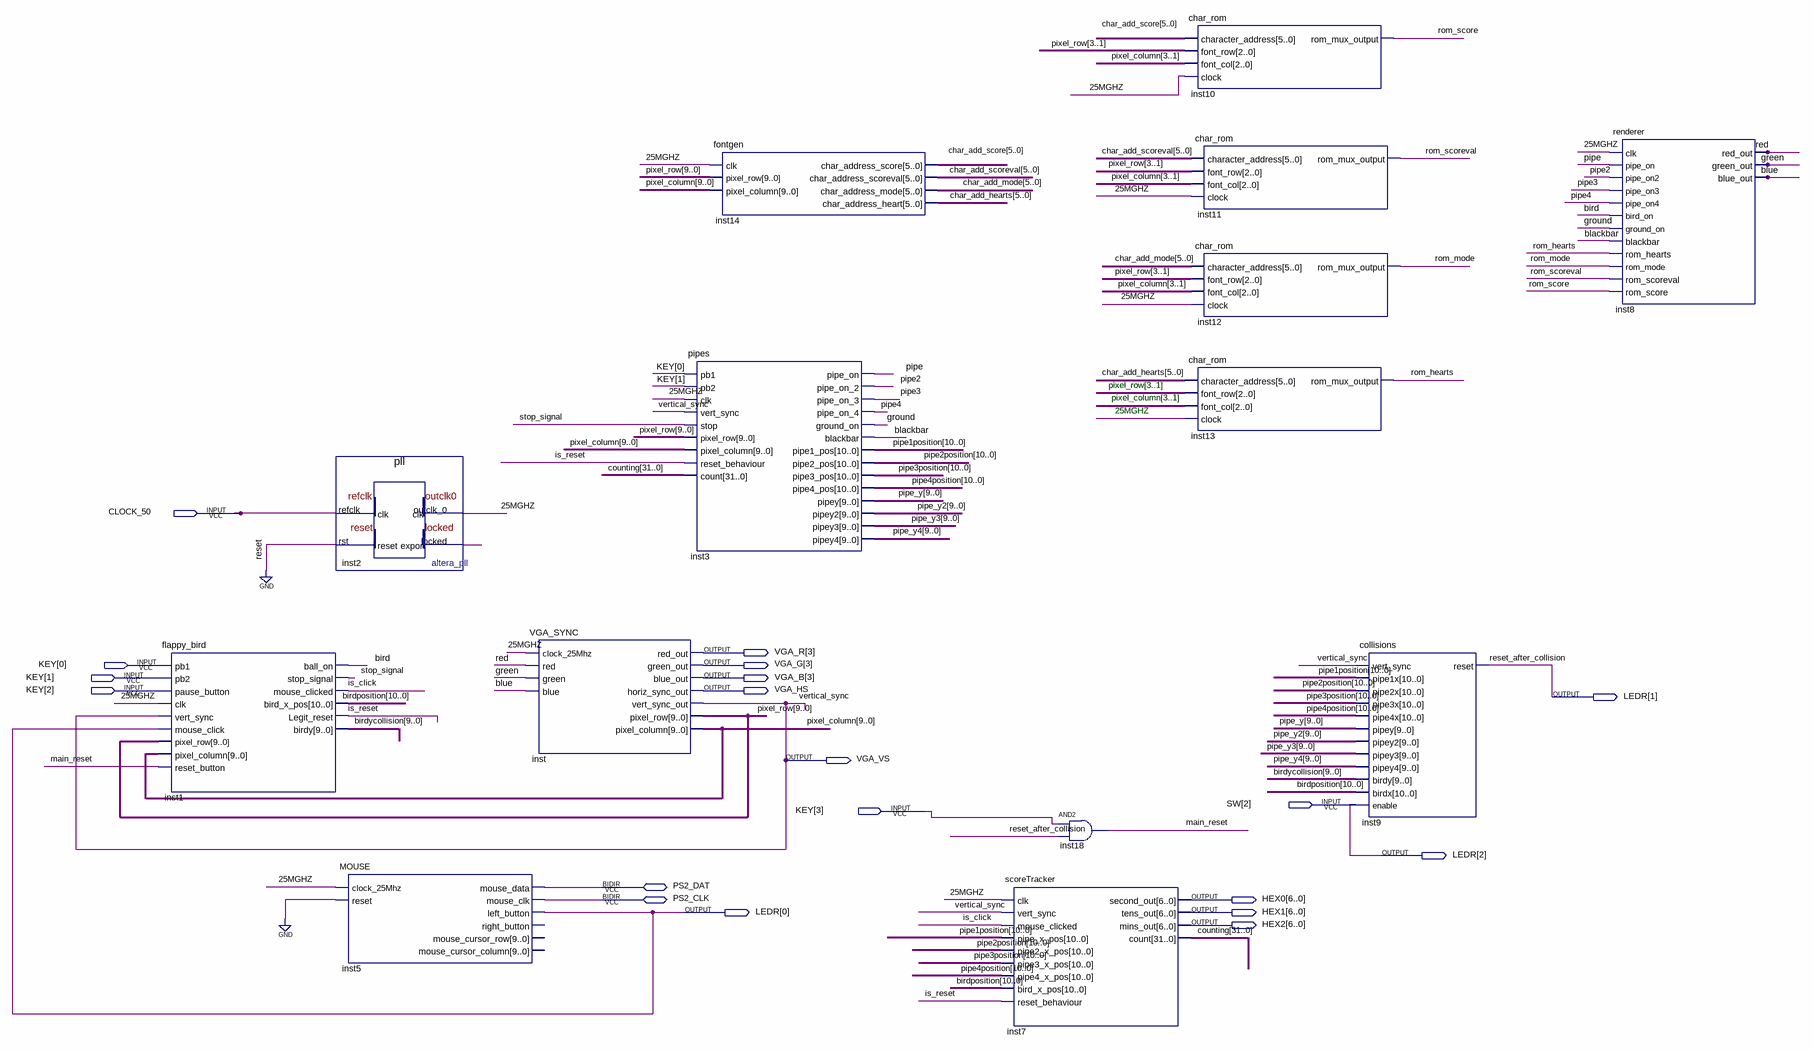
[diagram p0: schematic sheet]
// Quartus schematic FlappyBird.bdf as structural Verilog: 14 symbols, 19 pins
module FlappyBird (
  input  CLOCK_50,
  input  [3:0] KEY,
  input  [2:2] SW,
  inout  PS2_DAT,
  inout  PS2_CLK,
  output [3:3] VGA_R,
  output [3:3] VGA_G,
  output [3:3] VGA_B,
  output VGA_HS,
  output [2:0] LEDR,
  output VGA_VS,
  output [6:0] HEX0,
  output [6:0] HEX1,
  output [6:0] HEX2
);

  wire \25MGHZ , bird, blackbar, blue, green, ground, inst2_locked, is_click, is_reset, main_reset, pipe,
       pipe2, pipe3, pipe4, red, rom_hearts, rom_mode, rom_score, rom_scoreval, stop_signal;
  wire [5:0] char_add_hearts, char_add_mode, char_add_score, char_add_scoreval;
  wire [9:0] birdycollision, pipe_y, pipe_y2, pipe_y3, pipe_y4, pixel_column, pixel_row;
  wire [10:0] birdposition, pipe1position, pipe2position, pipe3position, pipe4position;
  wire [31:0] counting;

  flappy_bird inst1 (
    .pb2(KEY[1]), .pause_button(KEY[2]), .clk(\25MGHZ ), .vert_sync(VGA_VS), .mouse_click(LEDR[0]),
    .pixel_row(pixel_row), .pixel_column(pixel_column), .reset_button(main_reset), .ball_on(bird),
    .stop_signal(stop_signal), .mouse_clicked(is_click), .bird_x_pos(birdposition), .Legit_reset(is_reset),
    .birdy(birdycollision));  // open: pb1
  pll inst2 (.refclk(CLOCK_50), .rst(1'b0), .outclk_0(\25MGHZ ), .locked(inst2_locked));
  MOUSE inst5 (
    .clock_25Mhz(\25MGHZ ), .reset(1'b0), .left_button(LEDR[0]), .mouse_data(PS2_DAT), .mouse_clk(PS2_CLK));  // open: right_button, mouse_cursor_row, mouse_cursor_column
  VGA_SYNC inst (
    .clock_25Mhz(\25MGHZ ), .red(red), .green(green), .blue(blue), .red_out(VGA_R[3]), .green_out(VGA_G[3]),
    .blue_out(VGA_B[3]), .horiz_sync_out(VGA_HS), .vert_sync_out(VGA_VS), .pixel_row(pixel_row),
    .pixel_column(pixel_column));
  pipes inst3 (
    .pb1(KEY[0]), .pb2(KEY[1]), .clk(\25MGHZ ), .vert_sync(VGA_VS), .stop(stop_signal),
    .pixel_row(pixel_row), .pixel_column(pixel_column), .reset_behaviour(is_reset), .count(counting),
    .pipe_on(pipe), .pipe_on_2(pipe2), .pipe_on_3(pipe3), .pipe_on_4(pipe4), .ground_on(ground),
    .blackbar(blackbar), .pipe1_pos(pipe1position), .pipe2_pos(pipe2position), .pipe3_pos(pipe3position),
    .pipe4_pos(pipe4position), .pipey(pipe_y), .pipey2(pipe_y2), .pipey3(pipe_y3), .pipey4(pipe_y4));
  fontgen inst14 (
    .clk(\25MGHZ ), .pixel_row(pixel_row), .pixel_column(pixel_column), .char_address_score(char_add_score),
    .char_address_scoreval(char_add_scoreval), .char_address_mode(char_add_mode),
    .char_address_heart(char_add_hearts));
  scoreTracker inst7 (
    .clk(\25MGHZ ), .vert_sync(VGA_VS), .mouse_clicked(is_click), .pipe_x_pos(pipe1position),
    .pipe2_x_pos(pipe2position), .pipe3_x_pos(pipe3position), .pipe4_x_pos(pipe4position),
    .bird_x_pos(birdposition), .reset_behaviour(is_reset), .second_out(HEX0), .tens_out(HEX1),
    .mins_out(HEX2), .count(counting));
  and inst18 (main_reset, KEY[3], LEDR[1]);
  char_rom inst10 (
    .character_address(char_add_score), .font_row(pixel_row[3:1]), .font_col(pixel_column[3:1]),
    .clock(\25MGHZ ), .rom_mux_output(rom_score));
  char_rom inst11 (
    .character_address(char_add_scoreval), .font_row(pixel_row[3:1]), .font_col(pixel_column[3:1]),
    .clock(\25MGHZ ), .rom_mux_output(rom_scoreval));
  char_rom inst12 (
    .character_address(char_add_mode), .font_row(pixel_row[3:1]), .font_col(pixel_column[3:1]),
    .clock(\25MGHZ ), .rom_mux_output(rom_mode));
  char_rom inst13 (
    .character_address(char_add_hearts), .font_row(pixel_row[3:1]), .font_col(pixel_column[3:1]),
    .clock(\25MGHZ ), .rom_mux_output(rom_hearts));
  collisions inst9 (
    .vert_sync(VGA_VS), .pipe1x(pipe1position), .pipe2x(pipe2position), .pipe3x(pipe3position),
    .pipe4x(pipe4position), .pipey(pipe_y), .pipey2(pipe_y2), .pipey3(pipe_y3), .pipey4(pipe_y4),
    .birdy(birdycollision), .birdx(birdposition), .enable(SW[2]), .reset(LEDR[1]));
  renderer inst8 (
    .clk(\25MGHZ ), .pipe_on(pipe), .pipe_on2(pipe2), .pipe_on3(pipe3), .pipe_on4(pipe4), .bird_on(bird),
    .ground_on(ground), .blackbar(blackbar), .rom_hearts(rom_hearts), .rom_mode(rom_mode),
    .rom_scoreval(rom_scoreval), .rom_score(rom_score), .red_out(red), .green_out(green), .blue_out(blue));

  assign LEDR[2] = SW[2];

  // Other names for the same wires on the sheet: reset_after_collision = LEDR[1]; vertical_sync = VGA_VS

  // Notes on the sheet:
  //   pixel_row[3..1]
  //   pixel_column[3..1]
  //   25MGHZ
endmodule
